# EAGLE design hdd-booster (EAGLE 9.6.2)
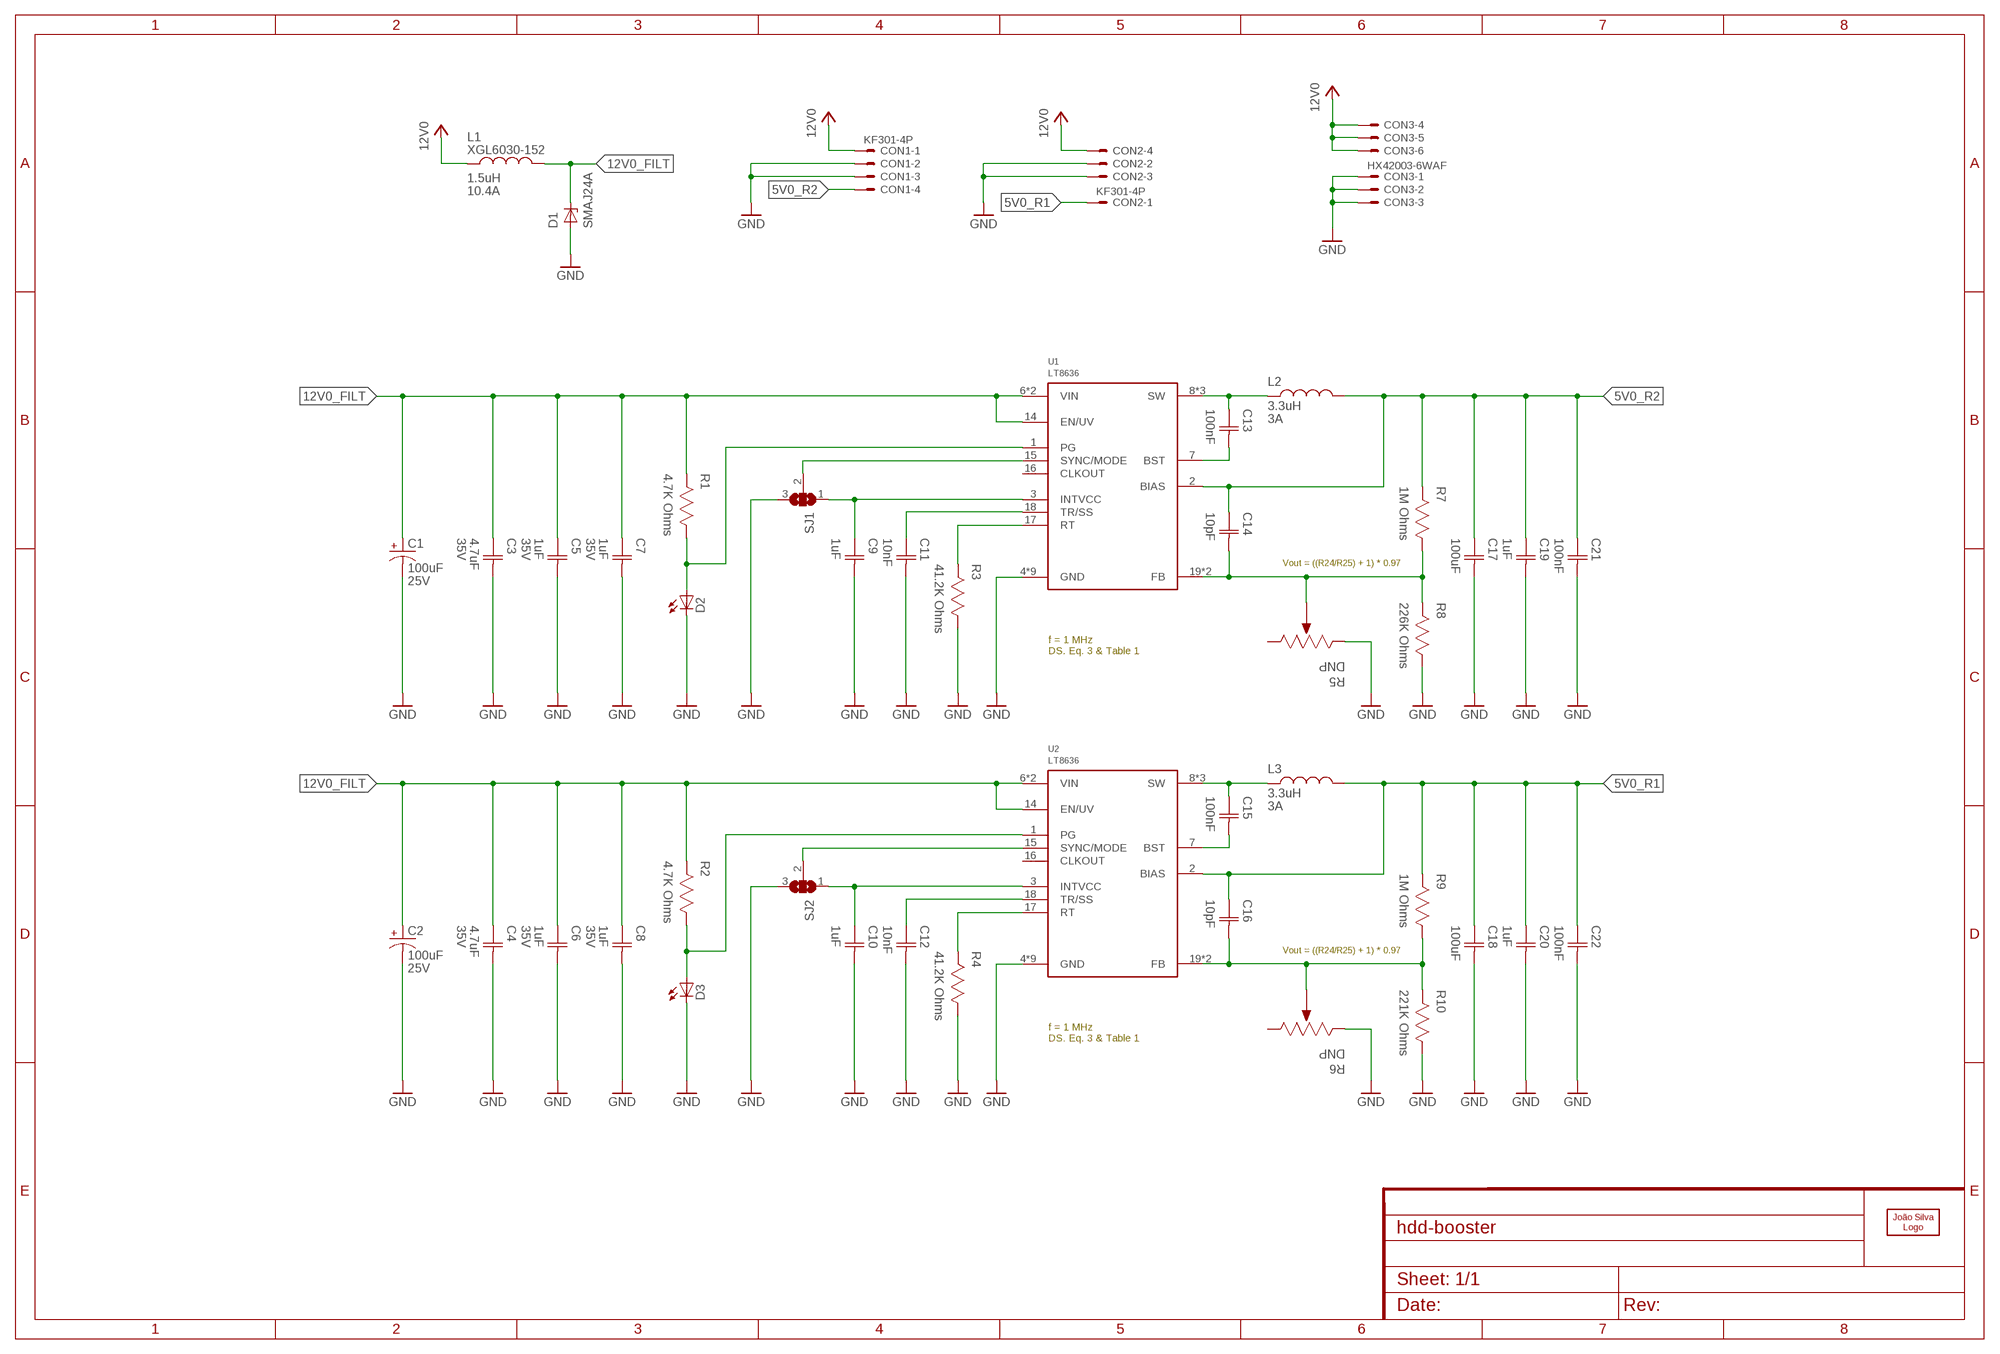
[diagram p0: schematic, sheet 1]

## Parts
C1  100uF  ALUMINIUM-CAPACITOR-CASE-D  [AL-CAP-CASE-D]
C2  100uF  ALUMINIUM-CAPACITOR-CASE-D  [AL-CAP-CASE-D]
C3  4.7uF  CAPACITOR-0603  [CAP0603]
C4  4.7uF  CAPACITOR-0603  [CAP0603]
C5  1uF  CAPACITOR-0402  [CAP0402]
C6  1uF  CAPACITOR-0402  [CAP0402]
C7  1uF  CAPACITOR-0402  [CAP0402]
C8  1uF  CAPACITOR-0402  [CAP0402]
C9  1uF  CAPACITOR-0402  [CAP0402]
C10  1uF  CAPACITOR-0402  [CAP0402]
C11  10nF  CAPACITOR-0402  [CAP0402]
C12  10nF  CAPACITOR-0402  [CAP0402]
C13  100nF  CAPACITOR-0402  [CAP0402]
C14  10pF  CAPACITOR-0402  [CAP0402]
C15  100nF  CAPACITOR-0402  [CAP0402]
C16  10pF  CAPACITOR-0402  [CAP0402]
C17  100uF  CAPACITOR-1206  [CAP1206]
C18  100uF  CAPACITOR-1206  [CAP1206]
C19  1uF  CAPACITOR-0402  [CAP0402]
C20  1uF  CAPACITOR-0402  [CAP0402]
C21  100nF  CAPACITOR-0402  [CAP0402]
C22  100nF  CAPACITOR-0402  [CAP0402]
CON1  KF301-4P  [KF301-4P]
CON2  KF301-4P  [KF301-4P]
CON3  HX42003-6WAF  [HX42003-6WAF]
D1  SMAJ24A  [DO214AC]
D2  LED1206  [1206]
D3  LED1206  [1206]
L1  1.5uH  XGL6030-152  [XGL6030]
L2  3.3uH  XGL6030-332  [XGL6030]
L3  3.3uH  XGL6030-332  [XGL6030]
LOGO1  JSILVA-5MM  [JSILVA_5MM]
R1  4.7K Ohms  RESISTOR-0402  [RES0402]
R2  4.7K Ohms  RESISTOR-0402  [RES0402]
R3  41.2K Ohms  RESISTOR-0402  [RES0402]
R4  41.2K Ohms  RESISTOR-0402  [RES0402]
R5  DNP  POTENTIOMETER-SMD-3X3  [POT3MM]
R6  DNP  POTENTIOMETER-SMD-3X3  [POT3MM]
R7  1M Ohms  RESISTOR-0402  [RES0402]
R8  226K Ohms  RESISTOR-0402  [RES0402]
R9  1M Ohms  RESISTOR-0402  [RES0402]
R10  221K Ohms  RESISTOR-0402  [RES0402]
SJ1  SJ2S  [SJ2_S]
SJ2  SJ2S  [SJ2_S]
U1  LT8636  [QFN20_ASYM_3X4_CORNER]
U2  LT8636  [QFN20_ASYM_3X4_CORNER]

## Nets
5V0_R1: C16.1(C1) C18.1(C1) C20.1(C1) C22.1(C1) CON2.1 L3.2 R9.2 U2.2(BIAS)
5V0_R1_BST: C15.2(C2) U2.7(BST)
5V0_R1_FB: C16.2(C2) R6.2(WIPER) R9.1 R10.2 U2.19(FB) U2.20(FB)
5V0_R1_INTVCC: C10.1(C1) SJ2.1 U2.3(INTVCC)
5V0_R1_MODE: SJ2.2 U2.15(SYNC/MODE)
5V0_R1_PG: D3.A R2.1 U2.1(PG)
5V0_R1_RT: R4.2 U2.17(RT)
5V0_R1_SS: C12.1(C1) U2.18(TR/SS)
5V0_R1_SW: C15.1(C1) L3.1 U2.8(SW) U2.9(SW) U2.10(SW)
5V0_R2: C14.1(C1) C17.1(C1) C19.1(C1) C21.1(C1) CON1.4 L2.2 R7.2 U1.2(BIAS)
5V0_R2_BST: C13.2(C2) U1.7(BST)
5V0_R2_FB: C14.2(C2) R5.2(WIPER) R7.1 R8.2 U1.19(FB) U1.20(FB)
5V0_R2_INTVCC: C9.1(C1) SJ1.1 U1.3(INTVCC)
5V0_R2_MODE: SJ1.2 U1.15(SYNC/MODE)
5V0_R2_PG: D2.A R1.1 U1.1(PG)
5V0_R2_RT: R3.2 U1.17(RT)
5V0_R2_SS: C11.1(C1) U1.18(TR/SS)
5V0_R2_SW: C13.1(C1) L2.1 U1.8(SW) U1.9(SW) U1.10(SW)
12V0: CON1.1 CON2.4 CON3.4 CON3.5 CON3.6 L1.1
12V0_FILT: C1.1(+) C2.1(+) C3.1(C1) C4.1(C1) C5.1(C1) C6.1(C1) C7.1(C1) C8.1(C1) D1.C L1.2 R1.2 R2.2 U1.6(VIN) U1.11(VIN) U1.14(EN/UV) U2.6(VIN) U2.11(VIN) U2.14(EN/UV)
GND: C1.2(-) C2.2(-) C3.2(C2) C4.2(C2) C5.2(C2) C6.2(C2) C7.2(C2) C8.2(C2) C9.2(C2) C10.2(C2) C11.2(C2) C12.2(C2) C17.2(C2) C18.2(C2) C19.2(C2) C20.2(C2) C21.2(C2) C22.2(C2) CON1.2 CON1.3 CON2.2 CON2.3 CON3.1 CON3.2 CON3.3 D1.A D2.C D3.C R3.1 R4.1 R5.1(CCW) R6.1(CCW) R8.1 R10.1 SJ1.3 SJ2.3 U1.4(GND) U1.5(GND) U1.12(GND) U1.13(GND) U1.21(GND) U1.M1(GND) U1.M2(GND) U1.M3(GND) U1.M4(GND) U2.4(GND) U2.5(GND) U2.12(GND) U2.13(GND) U2.21(GND) U2.M1(GND) U2.M2(GND) U2.M3(GND) U2.M4(GND)
Unconnected: R5.3(CW) R6.3(CW) U1.16(CLKOUT) U2.16(CLKOUT)

## Notes on the sheet
- Vout = ((R24/R25) + 1) * 0.97
- f = 1 MHz
  DS. Eq. 3 & Table 1
- Vout = ((R24/R25) + 1) * 0.97
- f = 1 MHz
  DS. Eq. 3 & Table 1

## Library data of the parts
C1 C2 = Capacitor:ALUMINIUM-CAPACITOR; OCLCSC: C97813; VOLTAGE: 25V
C3-C8 = Capacitor:CAPACITOR; VOLTAGE: 35V
C9-C22 = Capacitor:CAPACITOR
CON1 CON2 = Generic Connector:KF301-4P
CON3 = Generic Connector:HX42003-6
D1 = TVS:SMAJ*A: SMAJ Series TVS Diodes Source: http://www.littelfuse.com/~/media/electronics/datasheets/tvs_diodes/littelfuse_tvs_diode_smaj_datasheet.pdf.pdf; MF: Littelfuse; MPN: SMAJ24A; OC_FARNELL: 1886345; OC_NEWARK: 06R1865
D2 D3 = LED:LED
L1 = Coilcraft:XGL6030-; CURRENT: 10.4A; REF: XGL6030-152
L2 L3 = Coilcraft:XGL6030-; CURRENT: 3A; OCLCSC: C326336; REF: XGL6030-332
LOGO1 = Silkscreen:JS
R1-R4 R7-R10 = Resistor:RESISTOR
R5 R6 = Potentiometer:POTENTIOMETER
SJ1 SJ2 = Solder Jumper:SJ2
U1 U2 = Analog Devices:LT8636

## Board
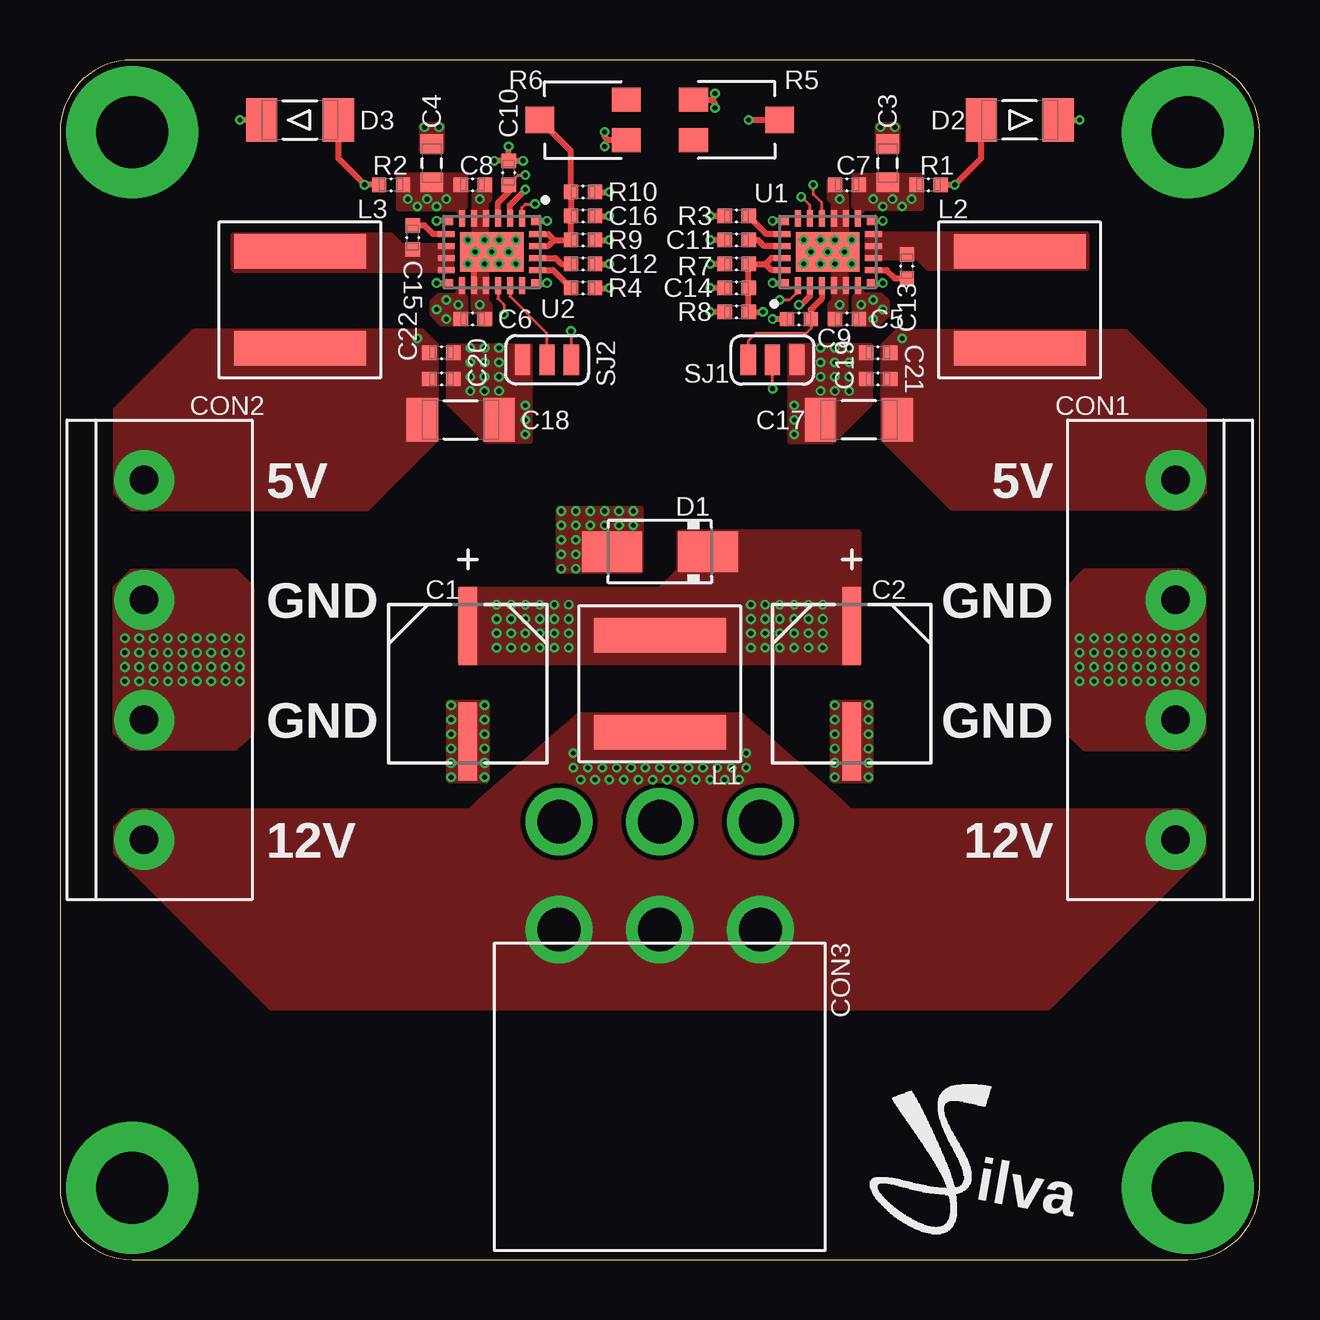
[diagram p1: board, top side]
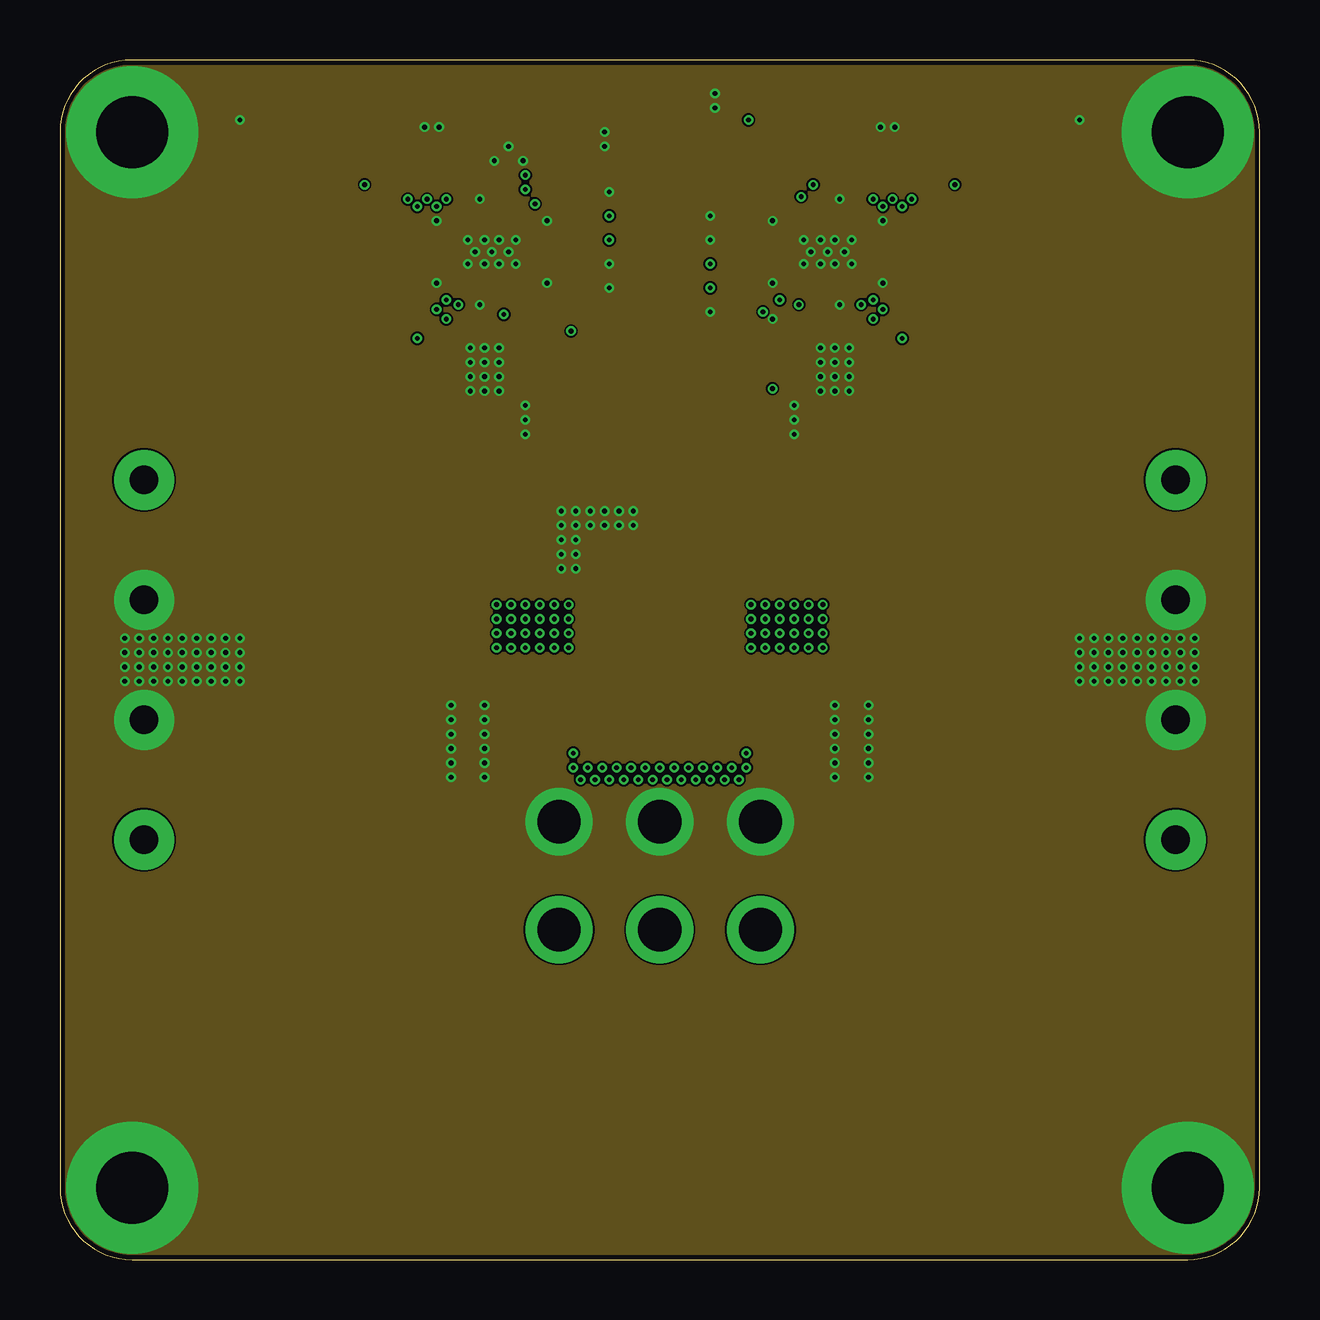
[diagram p2: board, inner layer Route2]
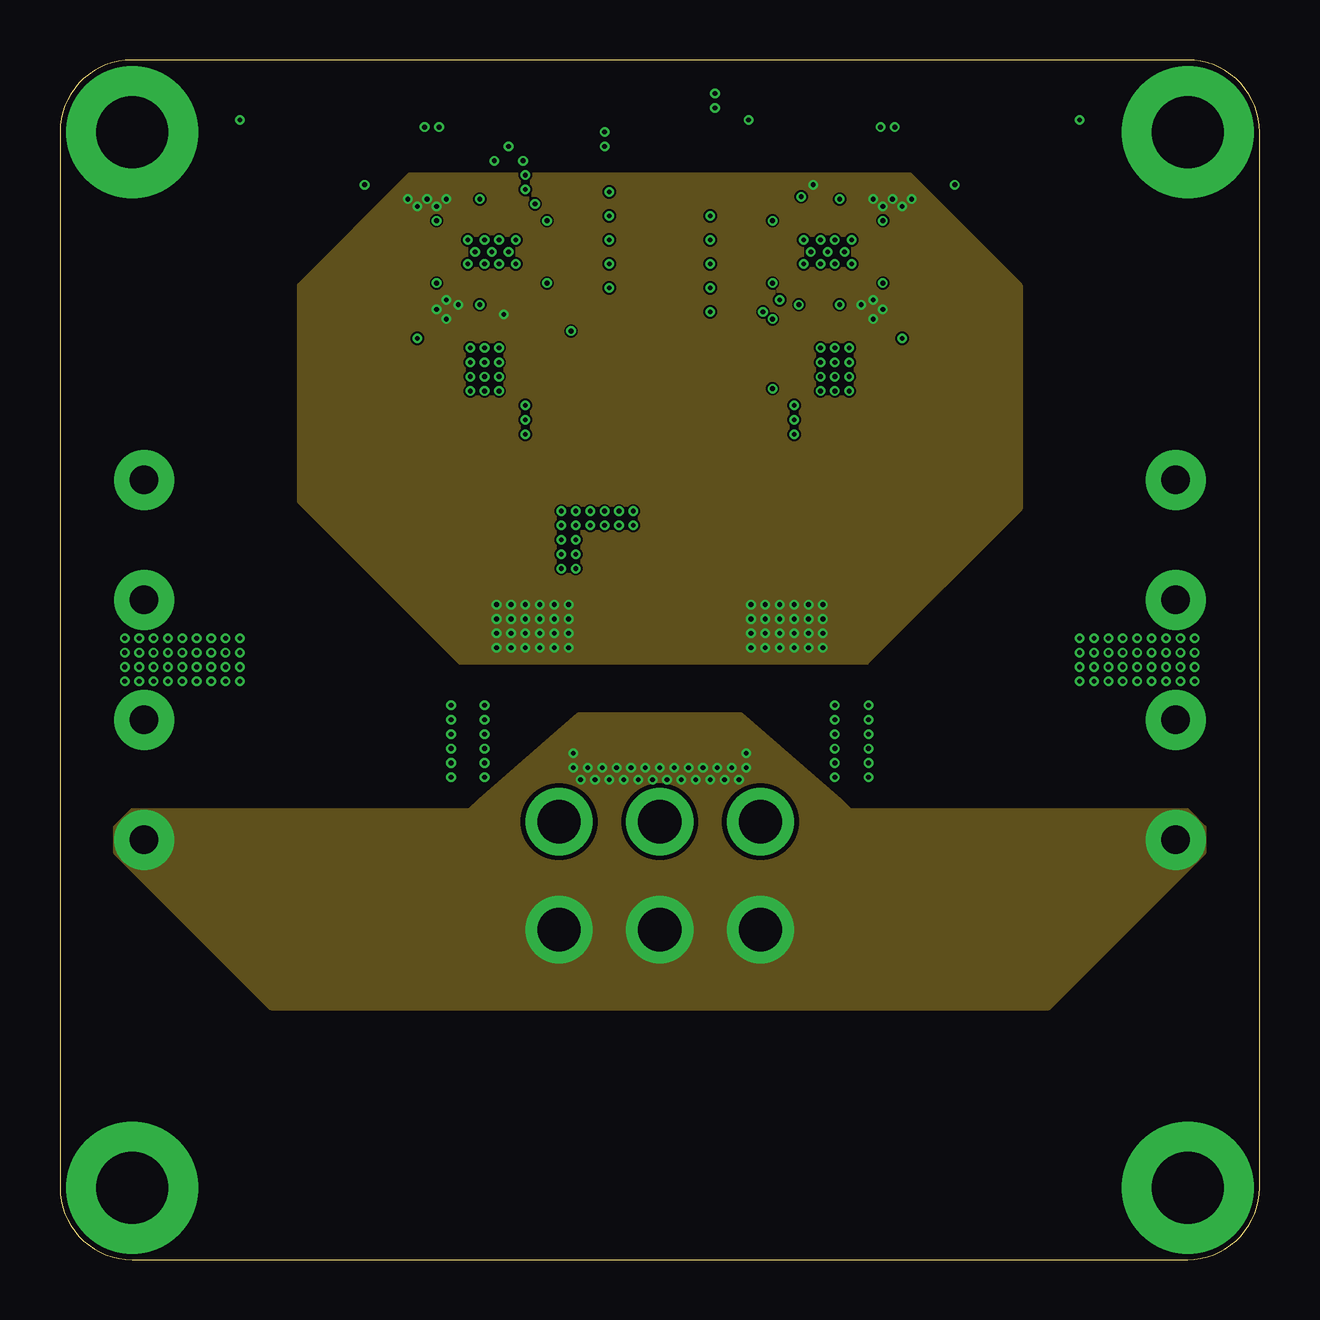
[diagram p3: board, inner layer Route3]
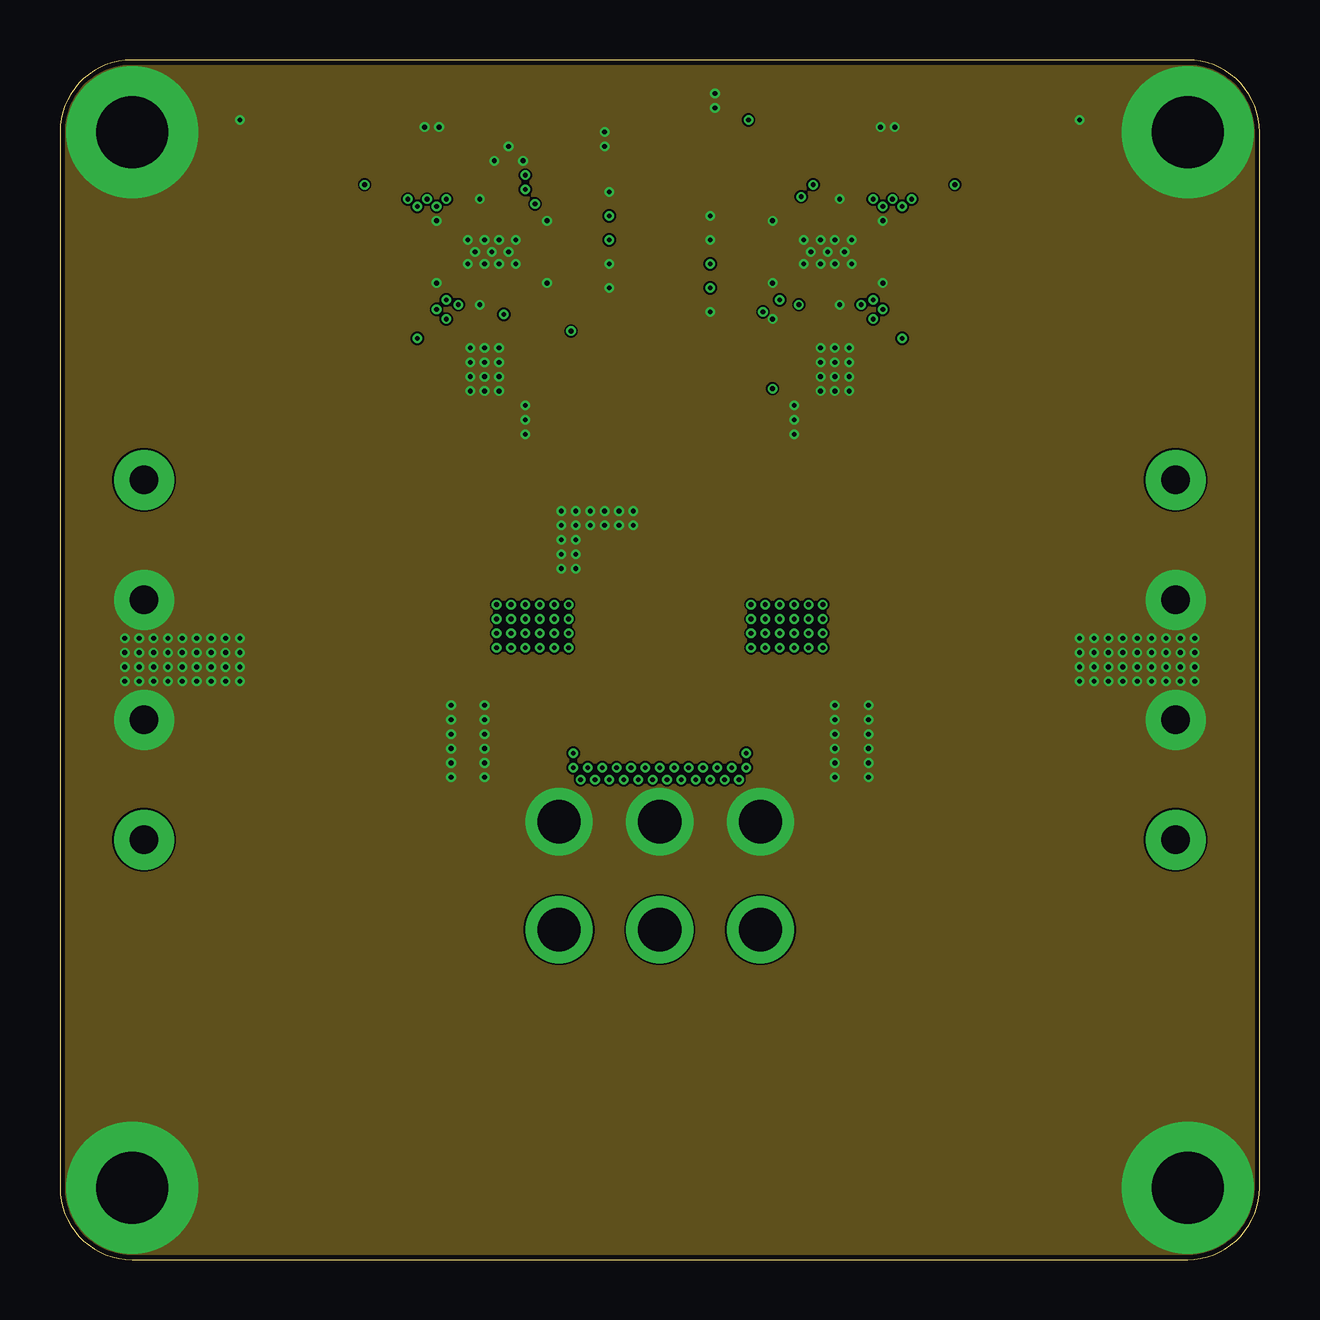
[diagram p4: board, inner layer Route4]
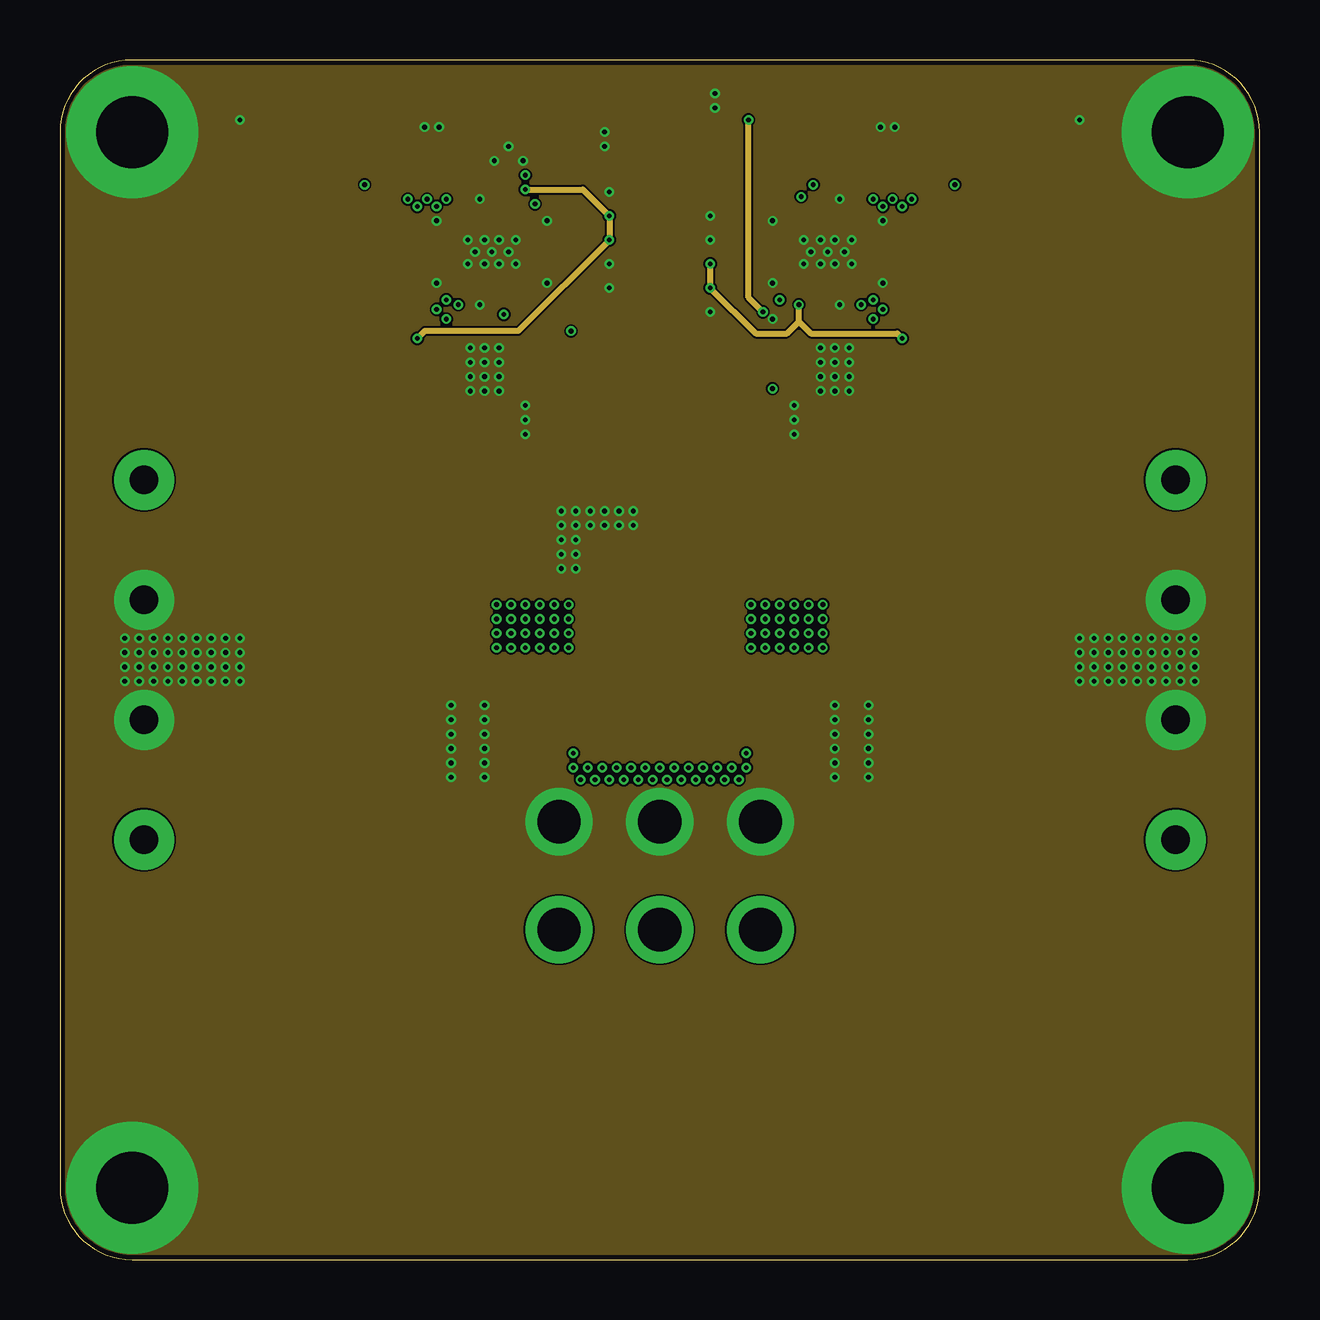
[diagram p5: board, inner layer Route13]
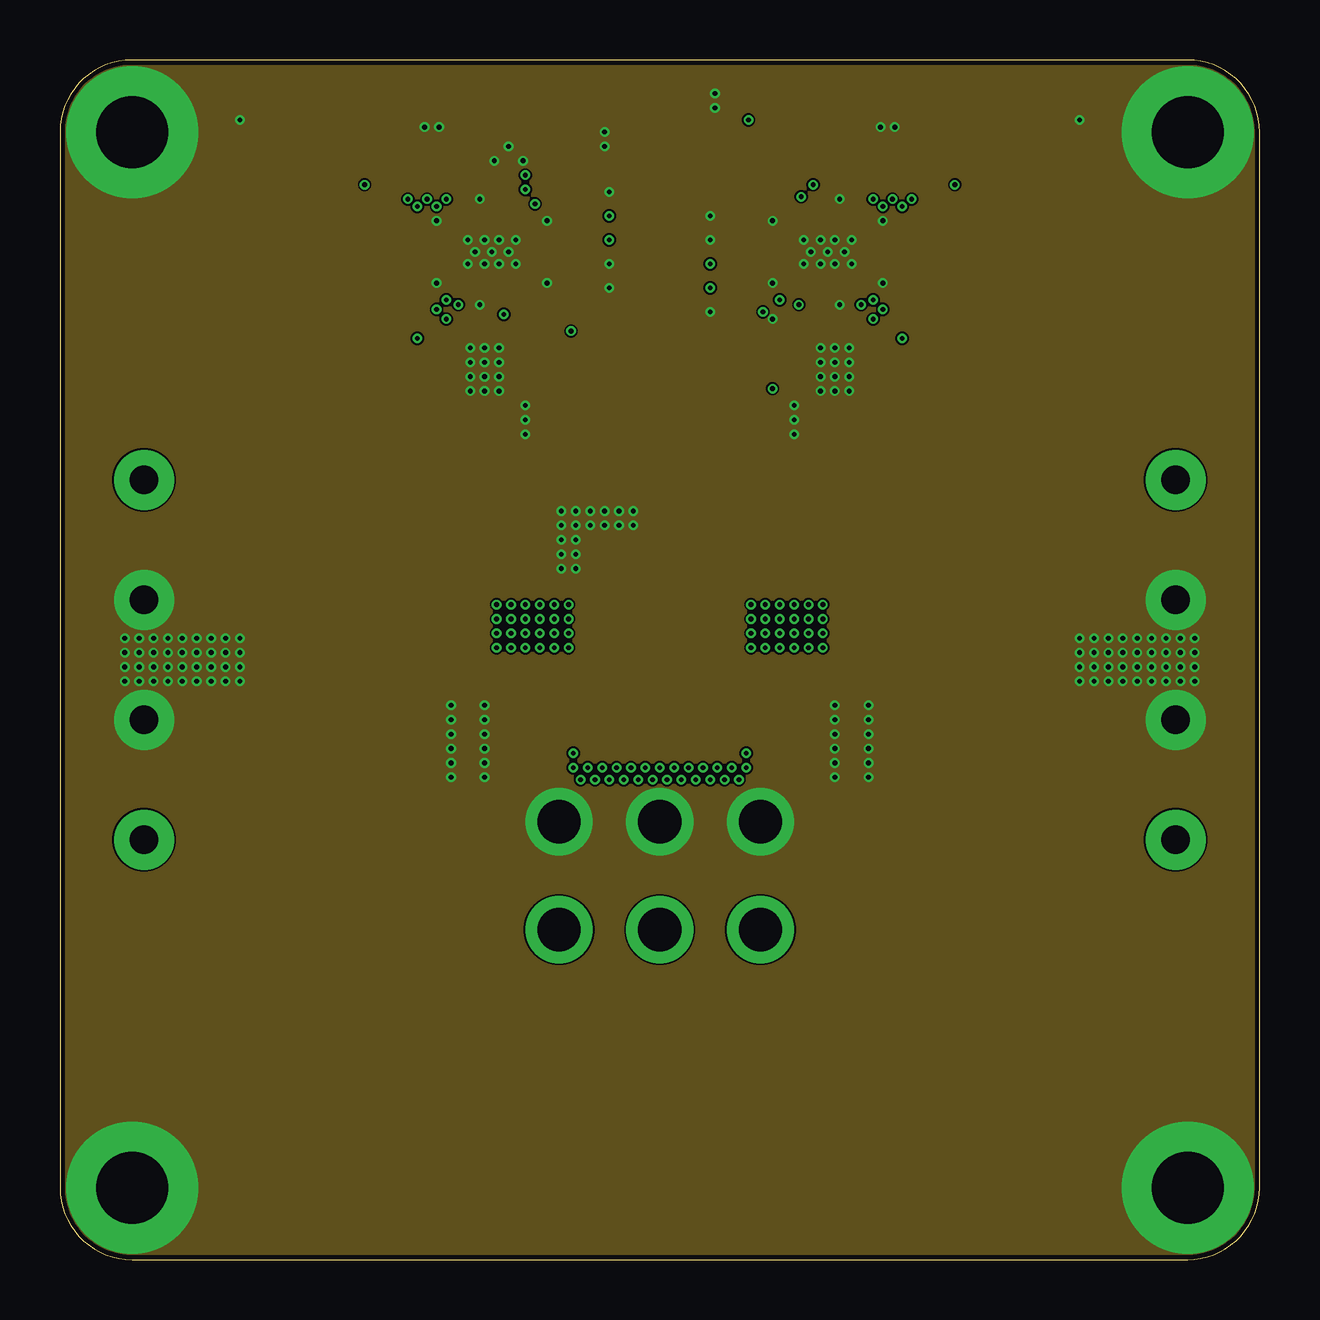
[diagram p6: board, inner layer Route14]
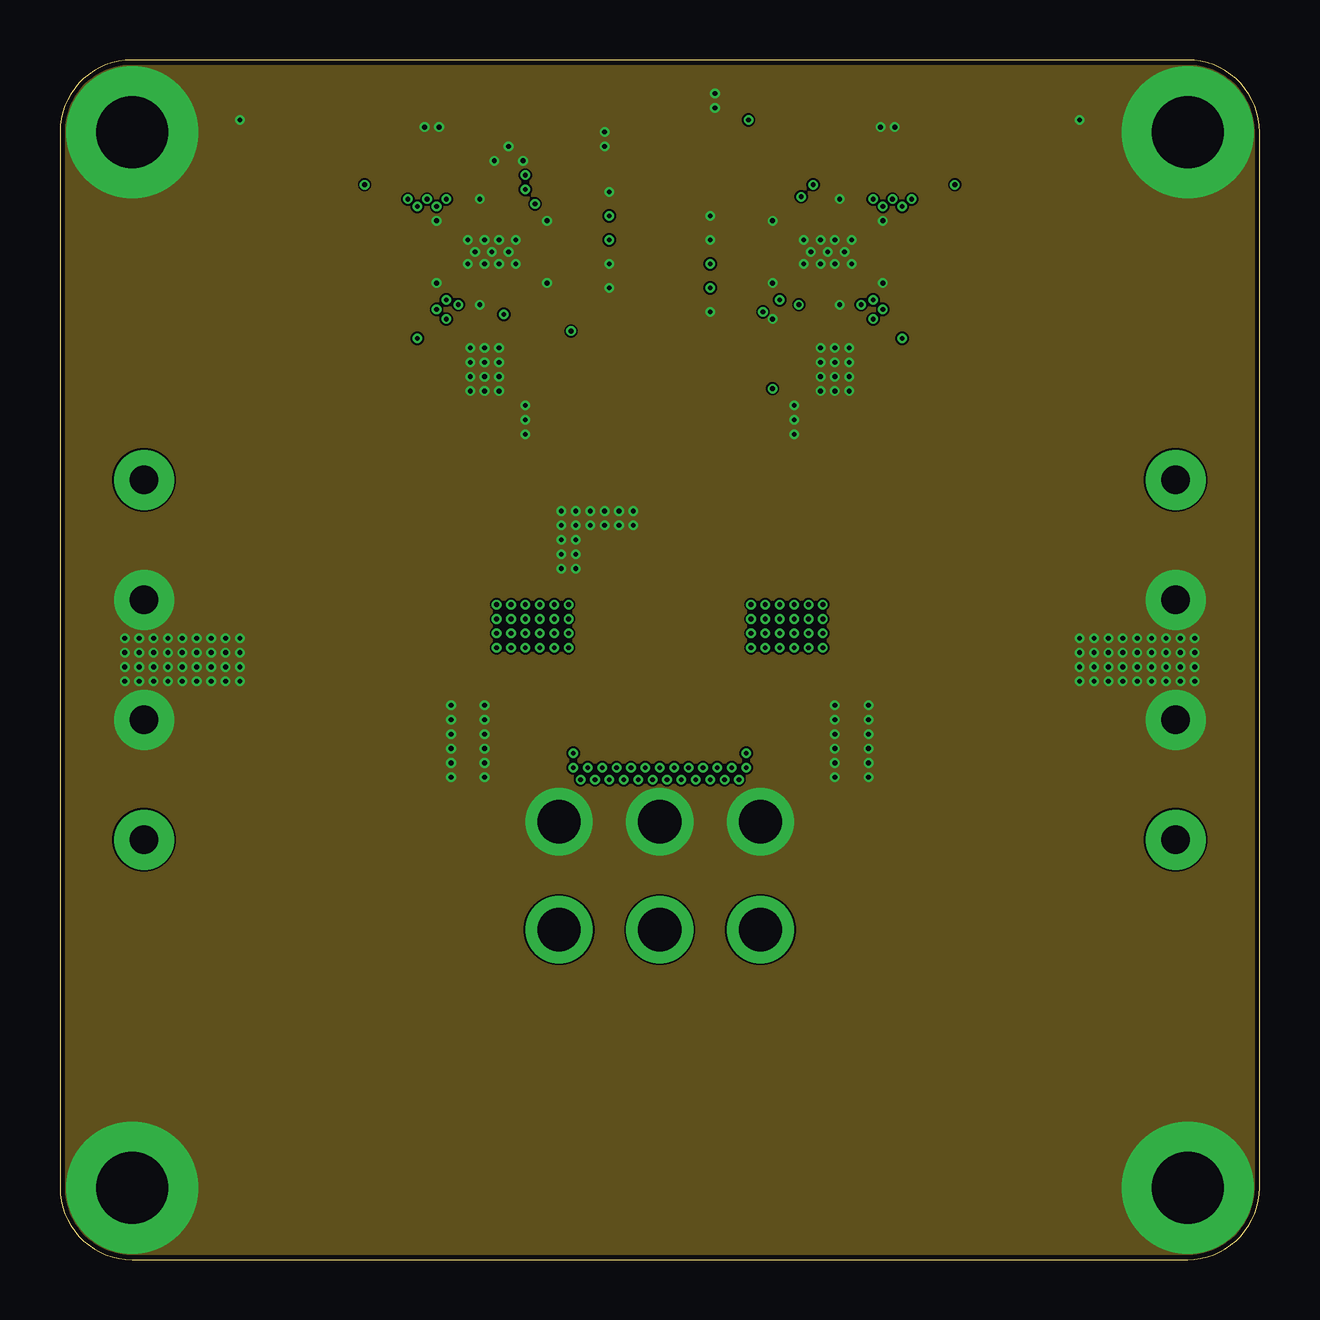
[diagram p7: board, inner layer Route15]
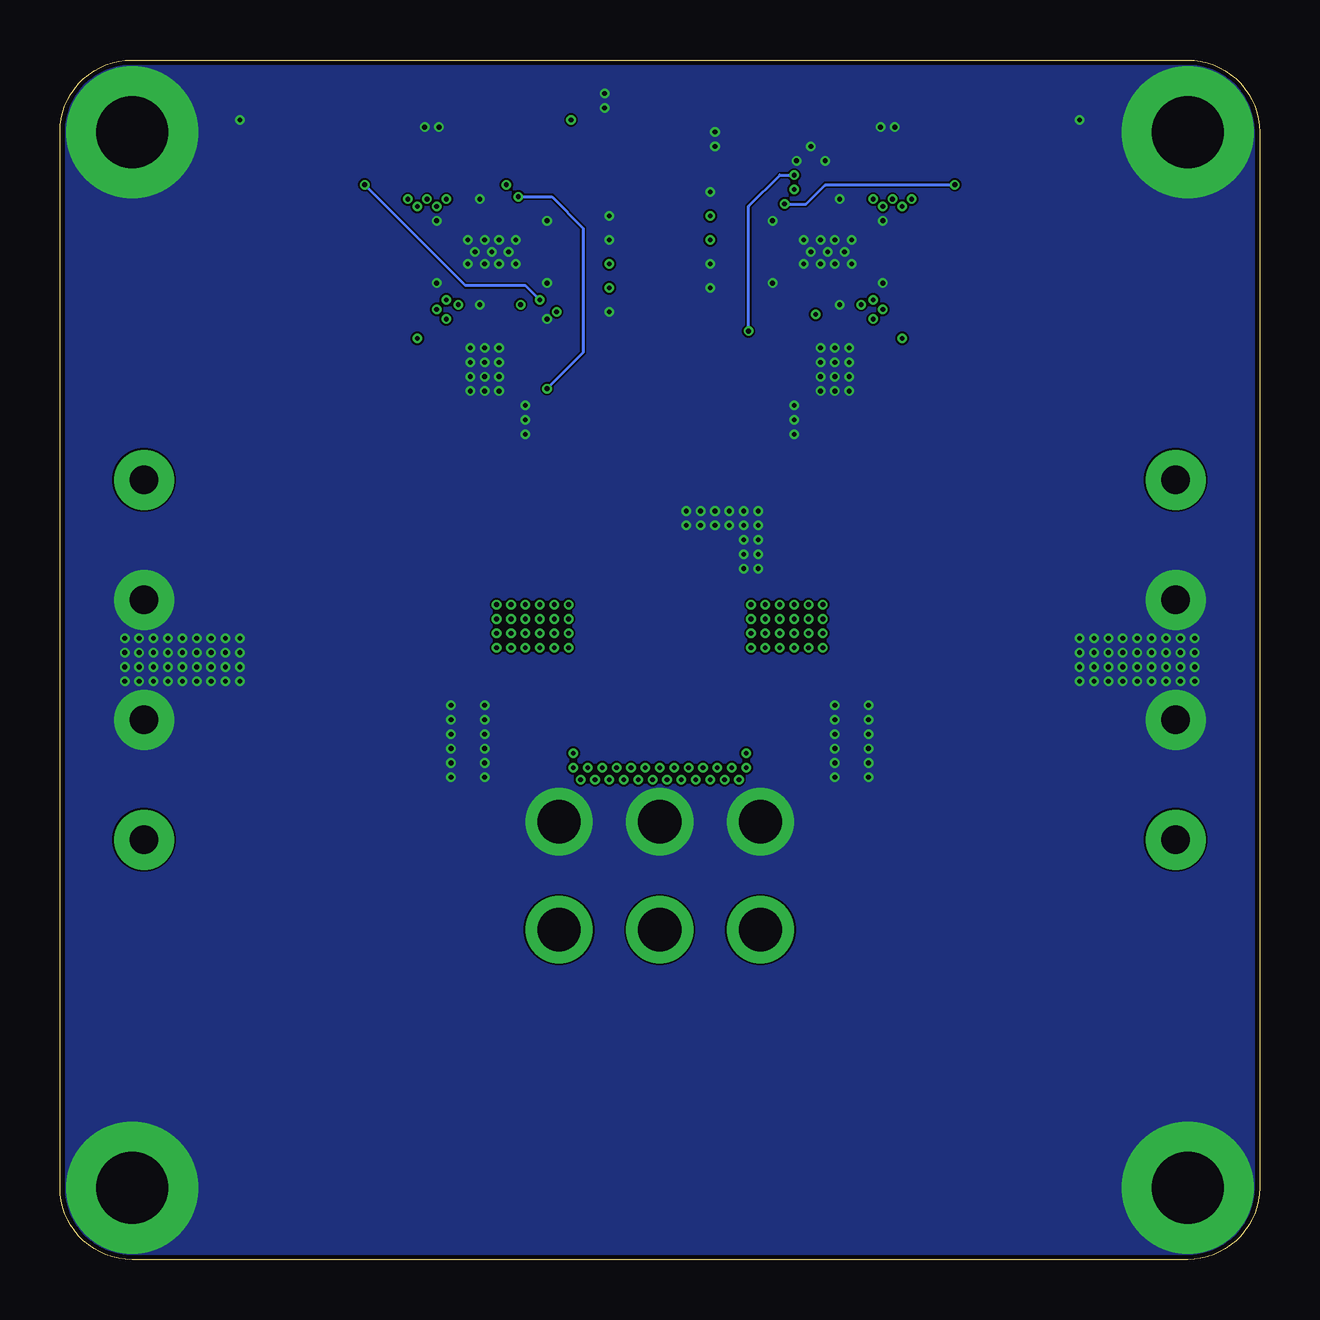
[diagram p8: board, bottom side, seen from below]

Size 50 x 50 mm. Coordinates in mm from the lower left corner, seen from the top.
Outline: 0,47 0,3 arc90 3,0 47,0 arc90 50,3 50,47 arc90 47,50 3,50 arc90 0,47
Copper layers (1+2*3+4*13+14*15+16): Top 0.035mm / dielectric 0.1164mm / Route2 0.0152mm / dielectric 0.3mm / Route3 0.0152mm / dielectric 0.1528mm / Route4 0.0152mm / dielectric 0.3mm / Route13 0.0152mm / dielectric 0.1528mm / Route14 0.0152mm / dielectric 0.3mm / Route15 0.0152mm / dielectric 0.1164mm / Bottom 0.035mm
Design rules "jlcpcb_8layer": minimum track width 3mil, minimum drill 0.15mm, track to track 3mil, track to pad 3mil, pad to pad 0.15mm, via to via 0.1mm, smd to smd 0mil, copper to edge 0.2mm, drill to drill 0.2mm, minimum pad ring 0.075mm, minimum via ring 0.075mm, stop-mask expansion 0.04mm, vias tented up to drill 10mm, thermal gap 0.1mm

### Footprints (pad centres in the part's own frame; a part is rotated, then mirrored left to right if it is on the bottom)
AL-CAP-CASE-D = smd 3.251 x 0.762: 1 -2.413,0; 2 2.413,0
CAP0603 = smd 0.8 x 0.95: 1 -0.8,0; 2 0.8,0
CAP0402 = smd 0.6 x 0.6: 1 -0.5,0; 2 0.5,0
CAP1206 = smd 1.3 x 1.8: 1 -1.6,0; 2 1.6,0
KF301-4P = drill 1.2 pad 2.5: 1 -7.5,0; 2 -2.5,0; 3 2.5,0; 4 7.5,0
HX42003-6WAF = drill 1.8 pad 2.8: 1 -4.2,-2.25; 2 0,-2.25; 3 4.2,-2.25; 4 -4.2,2.25; 5 0,2.25; 6 4.2,2.25
DO214AC = smd 2.5 x 1.7: A 2,0; C -2,0
1206 = smd 1.3 x 1.8: A 1.6,0; C -1.6,0
XGL6030 = smd 1.43 x 5.5: 1 -2.02,0; 2 2.02,0
RES0402 = smd 0.6 x 0.6: 1 -0.5,0; 2 0.5,0
POT3MM = smd 1 x 1.2: 1 -0.85,-1.8; 3 0.85,-1.8 | smd 1.1 x 1.2: 2 0,1.8
SJ2_S = smd 0.635 x 1.27: 1 -1.016,0; 2 0,0; 3 1.016,0
QFN20_ASYM_3X4_CORNER = smd 0.7 x 0.25: 1 -1.4,1.25; 2 -1.4,0.75; 3 -1.4,0.25; 4 -1.4,-0.25; 5 -1.4,-0.75; 6 -1.4,-1.25; 11 1.4,-1.25; 12 1.4,-0.75; 13 1.4,-0.25; 14 1.4,0.25; 15 1.4,0.75; 16 1.4,1.25 | smd 0.25 x 0.7: 7 -0.75,-1.9; 8 -0.25,-1.9; 9 0.25,-1.9; 10 0.75,-1.9; 17 0.75,1.9; 18 0.25,1.9; 19 -0.25,1.9; 20 -0.75,1.9 | smd 1.65 x 2.65: 21 0,0 | smd 0.375 x 0.375: M1 -1.312,1.812; M2 1.312,1.812; M3 -1.312,-1.812; M4 1.312,-1.812

### Placement (x,y rotation side)
C1  17,24 270 top
C2  33,24 270 top
C3  34.5,45.7 90 top
C4  15.5,45.7 90 top
C5  32.8,39.2 180 top
C6  17.2,39.2 0 top
C7  32.8,44.8 180 top
C8  17.2,44.8 0 top
C9  30.8,39.2 180 top
C10  18.7,45.3 90 top
C11  28.2,42.5 180 top
C12  21.8,41.5 0 top
C13  35.3,41.4 270 top
C14  28.2,40.5 0 top
C15  14.7,42.6 90 top
C16  21.8,43.5 180 top
C17  33.3,35 180 top
C18  16.7,35 0 top
C19  34.1,36.7 180 top
C20  15.9,36.7 0 top
C21  34.1,37.8 180 top
C22  15.9,37.8 0 top
CON1  46.5,25 90 top
CON2  3.5,25 270 top
CON3  25,16 180 top
D1  25,29.5 180 top
D2  40,47.5 180 top
D3  10,47.5 0 top
L1  25,24 90 top
L2  40,40 270 top
L3  10,40 270 top
LOGO1  39,7.5 0 top
R1  36.2,44.8 180 top
R2  13.8,44.8 0 top
R3  28.2,43.5 0 top
R4  21.8,40.5 180 top
R5  28.2,47.5 270 top
R6  21.8,47.5 90 top
R7  28.2,41.5 180 top
R8  28.2,39.5 0 top
R9  21.8,42.5 0 top
R10  21.8,44.5 180 top
SJ1  29.7,37.5 0 top
SJ2  20.3,37.5 180 top
U1  32,42 90 top
U2  18,42 270 top

### Tracks (layer width: path | path; a pad name or v marks a point on that pad's centre or on a via)
5V0_R1  (via drill 0.2)
  Top 0.254: U2.2 18.75,43.95 v19.4,44.6 | C16.1 v22.9,43.5 | R9.2 v22.9,42.5
  Route13 0.254: v19.4,44.6 21.8,44.6 v22.9,43.5 v22.9,42.5 19.1,38.7 17.5,38.7 15.2,38.7 v14.9,38.4
  pour Top (no thermals): 2.3,35.4 2.3,32 3,31.3 12.8,31.3 15.7,34.2 15.7,38.1 15.1,38.7 5.6,38.7
5V0_R1_BST
  Top 0.254: U2.7 15.55,42.75 15.2,43.1 C15.2
5V0_R1_FB
  Top 0.254: U2.19 20.35,42.25 20.6,42.5 | U2.20 20.35,42.75 20.6,42.5 | 20.6,42.5 R9.1 C16.2 R10.2 21.3,46.2 R6.2
5V0_R1_INTVCC  (via drill 0.2)
  Top 0.127: C10.1 19.1,45.2 v19.4,45.2 | SJ2.1 21.32,38.68 v21.3,38.7
  Top 0.254: U2.3 18.25,44.05 18.7,44.5 C10.1
  Bottom 0.127: v21.3,38.7 21.3,43.9 20,45.2 v19.4,45.2
5V0_R1_MODE
  Top 0.127: U2.15 18.75,40.15 20.3,38.6 SJ2.2
5V0_R1_PG  (via drill 0.2)
  Top 0.127: U2.1 19.25,43.85 19.4,44 v19.8,44
  Top 0.254: R2.1 v12.7,44.8 11.6,45.9 D3.A
  Bottom 0.127: v19.8,44 18.9,44 18.1,44.8 v12.7,44.8
5V0_R1_RT
  Top 0.254: U2.17 20.55,41.25 R4.2
5V0_R1_SS
  Top 0.254: U2.18 20.65,41.75 20.9,41.5 C12.1
5V0_R1_SW
  pour Top (no thermals): 16.35,42.27 14.23,42.27 13.8,42.7 7.2,42.7 7.2,41.3 7.27,41.23 16.35,41.23
5V0_R2  (via drill 0.2)
  Top 0.254: C14.1 v27.1,40.5 | R7.2 v27.1,41.5 | U1.2 31.25,40.15 30.9,39.8 v30.8,39.8
  Route13 0.254: v27.1,41.5 v27.1,40.5 29,38.6 30.3,38.6 30.8,39.1 | 30.8,39.1 v30.8,39.8 | 30.8,39.1 31.3,38.6 34.9,38.6 v35.1,38.4
  pour Top (no thermals): 47.7,35.4 47.7,32 47,31.3 37.2,31.3 34.3,34.2 34.3,38.1 34.9,38.7 44.4,38.7
5V0_R2_BST
  Top 0.254: U1.7 34.45,41.25 34.8,40.9 C13.2
5V0_R2_FB  (via drill 0.2)
  Top 0.254: U1.20 29.65,41.25 29.4,41.5 | U1.19 29.65,41.75 29.4,41.5 | 29.4,41.5 R7.1 C14.2 R8.2 v29.3,39.5 | R5.2 v28.7,47.5
  Route13 0.254: v29.3,39.5 28.7,40.1 v28.7,47.5
5V0_R2_INTVCC
  Top 0.127: C9.1 31.3,38.8 31.1,38.6 29,38.6 28.68,38.28 SJ1.1
  Top 0.254: U1.3 31.75,40.05 31.3,39.6 C9.1
5V0_R2_MODE  (via drill 0.2)
  Top 0.127: U1.15 31.25,43.95 v30.9,44.3 | v29.7,36.3 SJ1.2
  Bottom 0.127: v30.9,44.3 29.5,44.3 28.2,43 28.2,37.8 v29.7,36.3
5V0_R2_PG  (via drill 0.2)
  Top 0.127: U1.1 30.75,40.35 30.4,40 v30,40
  Top 0.254: R1.1 v37.3,44.8 38.4,45.9 D2.A
  Bottom 0.127: v30,40 30.6,40.6 33.1,40.6 v37.3,44.8
5V0_R2_RT
  Top 0.254: U1.17 29.45,42.75 R3.2
5V0_R2_SS
  Top 0.254: U1.18 29.35,42.25 29.1,42.5 C11.1
5V0_R2_SW
  pour Top (no thermals): 33.65,42.77 42.8,42.77 42.8,41.3 36.2,41.3 35.77,41.73 33.65,41.73
12V0  (via drill 0.2)
  other vias: 22,20.5 22.6,20.5 23.2,20.5 23.8,20.5 24.4,20.5 25.6,20.5 26.2,20.5 26.8,20.5 27.4,20.5 28,20.5 28.6,20.5 28.6,21.1 25,20.5 21.4,20.5 21.4,21.1 21.7,20 22.3,20 22.9,20 23.5,20 24.7,20 25.3,20 25.9,20 26.5,20 27.1,20 27.7,20 24.1,20 28.3,20
  pour Top (isolate 0.2, no thermals): 21.63,22.7 17.5,19.11 17.09,18.7 3,18.7 2.3,18 2.3,17 8.8,10.5 41.2,10.5 47.7,17 47.7,18 47,18.7 32.92,18.7 32.5,19.12 28.39,22.7
  pour Route3 (isolate 0.2, no thermals): 21.61,22.7 17.5,19.12 17.08,18.7 3,18.7 2.3,18 2.3,17 8.8,10.5 41.2,10.5 47.7,17 47.7,18 47,18.7 32.92,18.7 32.5,19.12 28.39,22.7
12V0_FILT  (via drill 0.2)
  Top 0.127: U2.14 18.25,40.05 18.5,39.8 v18.5,39.4 | U1.14 31.75,44.05 31.4,44.4 v31.4,44.8
  other vias: 18.2,26.7 18.8,26.7 19.4,26.7 20,26.7 20.6,26.7 21.2,26.7 21.2,27.3 20.6,27.3 20,27.3 19.4,27.3 18.8,27.3 18.2,27.3 21.2,26.1 20.6,26.1 20,26.1 19.4,26.1 18.8,26.1 18.2,26.1 18.2,25.5 18.8,25.5 19.4,25.5 20,25.5 20.6,25.5 21.2,25.5 28.8,26.7 29.4,26.7 30,26.7 30.6,26.7 31.2,26.7 31.8,26.7 31.8,27.3 31.2,27.3 30.6,27.3 30,27.3 29.4,27.3 28.8,27.3 31.8,26.1 31.2,26.1 30.6,26.1 30,26.1 29.4,26.1 28.8,26.1 28.8,25.5 29.4,25.5 30,25.5 30.6,25.5 31.2,25.5 31.8,25.5 16.1,44.2 15.7,43.9 15.3,44.2 16.1,40 16.6,39.8 15.7,39.6 16.1,39.2 14.5,44.2 14.9,43.9 33.9,44.2 34.3,43.9 34.7,44.2 33.9,40 33.4,39.8 34.3,39.6 33.9,39.2 35.5,44.2 35.1,43.9
  pour Top (no thermals): 16.9,39 15.9,39 15.5,39.4 15.5,39.9 15.8,40.2 16.5,40.2 16.72,40.42 16.72,40.85 16.78,40.85 16.78,40.22 16.9,40.1
  pour Top (no thermals): 16.9,45.2 14.1,45.2 14.1,43.8 16.5,43.8 16.72,43.58 16.72,43.15 16.78,43.15 16.78,43.78 16.9,43.9
  pour Top (isolate 0.2, no thermals): 16.7,24.9 33.3,24.9 33.3,30.3 25.8,30.3 25.8,28.7 25,27.9 16.7,27.9
  pour Route3 (no thermals): 16.7,24.9 10,31.6 10,40.6 14.6,45.2 35.4,45.2 40,40.6 40,31.3 33.6,24.9
  pour Top (no thermals): 33.1,39 34.1,39 34.5,39.4 34.5,39.9 34.2,40.2 33.5,40.2 33.28,40.42 33.28,40.85 33.22,40.85 33.22,40.22 33.1,40.1
  pour Top (no thermals): 33.1,45.2 35.9,45.2 35.9,43.8 33.5,43.8 33.28,43.58 33.28,43.15 33.22,43.15 33.22,43.78 33.1,43.9
GND  (via drill 0.2, 3 pad 5.5)
  Top 0.254: U2.12 17.25,41.25 | U2.M4 15.71,40.69 v15.7,40.7 | U2.M3 15.71,43.31 v15.7,43.3 | U2.M2 20.29,40.69 v20.3,40.7 | U2.M1 20.29,43.31 v20.3,43.3 | C10.2 v18.1,45.8 | C10.2 v18.7,46.4 | C10.2 v19.3,45.8 | R6.1 22.85,46.65 | 22.85,46.65 22.7,46.5 v22.7,46.4 | 22.85,46.65 22.7,46.8 v22.7,47 | R10.1 v22.9,44.5 | C12.2 v22.9,41.5 | R4.1 v22.9,40.5 | D3.C v7.5,47.5 | D2.C v42.5,47.5 | U1.M3 34.29,40.69 v34.3,40.7 | U1.M4 34.29,43.31 v34.3,43.3 | U1.M2 29.71,43.31 v29.7,43.3 | U1.M1 29.71,40.69 v29.7,40.7 | R8.1 v27.1,39.5 | C11.2 v27.1,42.5 | R3.1 v27.1,43.5 | R5.1 27.15,48.35 | 27.15,48.35 27.3,48.5 v27.3,48.6 | 27.15,48.35 27.3,48.2 v27.3,48 | C9.2 v29.7,39.2
  other vias: 47,3 47,47 3,47 3,3 17,42.5 17.3,42 17,41.5 17.7,41.5 18.3,41.5 19,41.5 18.7,42 19,42.5 18.3,42.5 17.7,42.5 18,42 17.5,44.2 17.5,39.8 15.8,47.2 15.2,47.2 21.5,28.8 20.9,28.8 20.9,29.4 20.9,30 20.9,30.6 21.5,30.6 21.5,30 21.5,29.4 22.1,30.6 22.7,30.6 23.3,30.6 23.9,30.6 23.9,31.2 23.3,31.2 22.7,31.2 22.1,31.2 21.5,31.2 20.9,31.2 16.3,23.1 16.3,22.5 16.3,21.9 16.3,21.3 16.3,20.7 16.3,20.1 17.7,20.1 17.7,20.7 17.7,21.3 17.7,21.9 17.7,22.5 17.7,23.1 32.3,23.1 32.3,22.5 32.3,21.9 32.3,21.3 32.3,20.7 32.3,20.1 33.7,20.1 33.7,20.7 33.7,21.3 33.7,21.9 33.7,22.5 33.7,23.1 4.5,25.3 5.1,25.3 5.7,25.3 6.3,25.3 6.9,25.3 7.5,25.3 7.5,25.9 6.9,25.9 6.3,25.9 5.7,25.9 5.1,25.9 4.5,25.9 7.5,24.7 6.9,24.7 6.3,24.7 5.7,24.7 5.1,24.7 4.5,24.7 4.5,24.1 5.1,24.1 5.7,24.1 6.3,24.1 6.9,24.1 7.5,24.1 3.3,25.3 3.9,25.3 3.9,25.9 3.3,25.9 3.9,24.7 3.3,24.7 3.3,24.1 3.9,24.1 2.7,25.3 2.7,25.9 2.7,24.7 2.7,24.1 45.5,25.3 44.9,25.3 44.3,25.3 43.7,25.3 43.1,25.3 42.5,25.3 42.5,25.9 43.1,25.9 43.7,25.9 44.3,25.9 44.9,25.9 45.5,25.9 42.5,24.7 43.1,24.7 43.7,24.7 44.3,24.7 44.9,24.7 45.5,24.7 45.5,24.1 44.9,24.1 44.3,24.1 43.7,24.1 43.1,24.1 42.5,24.1 46.7,25.3 46.1,25.3 46.1,25.9 46.7,25.9 46.1,24.7 46.7,24.7 46.7,24.1 46.1,24.1 47.3,25.3 47.3,25.9 47.3,24.7 47.3,24.1 32.5,44.2 32.5,39.8 32.3,41.5 32,42 33,41.5 33,42.5 32.3,42.5 32.7,42 31,41.5 31,42.5 31.7,41.5 31.3,42 31.7,42.5 18.3,38 17.7,38 17.1,38 19.4,35.6 19.4,35 19.4,34.4 18.3,36.2 17.7,36.2 17.1,36.2 18.3,36.8 17.7,36.8 17.1,36.8 18.3,37.4 17.7,37.4 17.1,37.4 34.8,47.2 34.2,47.2 31.7,38 32.3,38 32.9,38 30.6,35.6 30.6,35 30.6,34.4 31.7,36.2 32.3,36.2 32.9,36.2 31.7,36.8 32.3,36.8 32.9,36.8 31.7,37.4 32.3,37.4 32.9,37.4
  pour Route2 (rank 6, no thermals): -2,-2 52,-2 52,52 -2,52
  pour Route4 (rank 6, no thermals): -4,-4 54,-4 54,54 -4,54
  pour Route13 (rank 6, no thermals): -5,-5 55,-5 55,55 -5,55
  pour Route14 (rank 6, no thermals): -6,-6 56,-6 56,56 -6,56
  pour Route15 (rank 6, no thermals): -7,-7 57,-7 57,57 -7,57
  pour Top (no thermals): 17.25,42.7 17.75,42.7 17.75,44.05 17.9,44.2 17.9,45 17.5,45 17.5,44.6 17.25,44.35
  pour Top (no thermals): 17.25,41.3 17.75,41.3 17.75,39.95 17.9,39.8 17.9,39 17.5,39 17.5,39.4 17.25,39.65
  pour Top (no thermals): 15.1,46.2 15.1,47.3 15.9,47.3 15.9,46.2
  pour Top (no thermals): 24.2,28.7 20.8,28.7 20.8,31.3 24.2,31.3
  pour Top (no thermals): 16.2,23.2 16.2,20 17.8,20 17.8,23.2
  pour Top (no thermals): 32.2,23.2 32.2,20 33.8,20 33.8,23.2
  pour Bottom (rank 6, no thermals): -8,-8 58,-8 58,58 -8,58
  pour Top (no thermals): 3.5,28.7 7.3,28.7 7.8,28.2 8,28 8,27.1 8,22 7.5,21.5 7.3,21.3 6.6,21.3 3,21.3 2.8,21.5 2.3,22 2.3,22.6 2.3,28 2.9,28.6 3,28.7
  pour Top (no thermals): 47,28.7 42.7,28.7 42,28 42,22 42.7,21.3 47,21.3 47.7,22 47.7,28
  pour Top (no thermals): 32.75,42.7 32.25,42.7 32.25,44.05 32.1,44.2 32.1,45 32.5,45 32.5,44.6 32.75,44.35
  pour Top (no thermals): 32.75,41.3 32.25,41.3 32.25,39.95 32.1,39.8 32.1,39 32.5,39 32.5,39.4 32.75,39.65
  pour Top (no thermals): 19.6,38.1 19.6,34.1 17.8,34.1 16.2,35.7 16.2,38.1
  pour Top (no thermals): 34.1,46.2 34.1,47.3 34.9,47.3 34.9,46.2
  pour Top (no thermals): 30.4,38.1 30.4,34.1 32.2,34.1 33.8,35.7 33.8,38.1

### Text on the board
tPlace: 5V | 5V | GND | GND | GND | GND | 12V | 12V